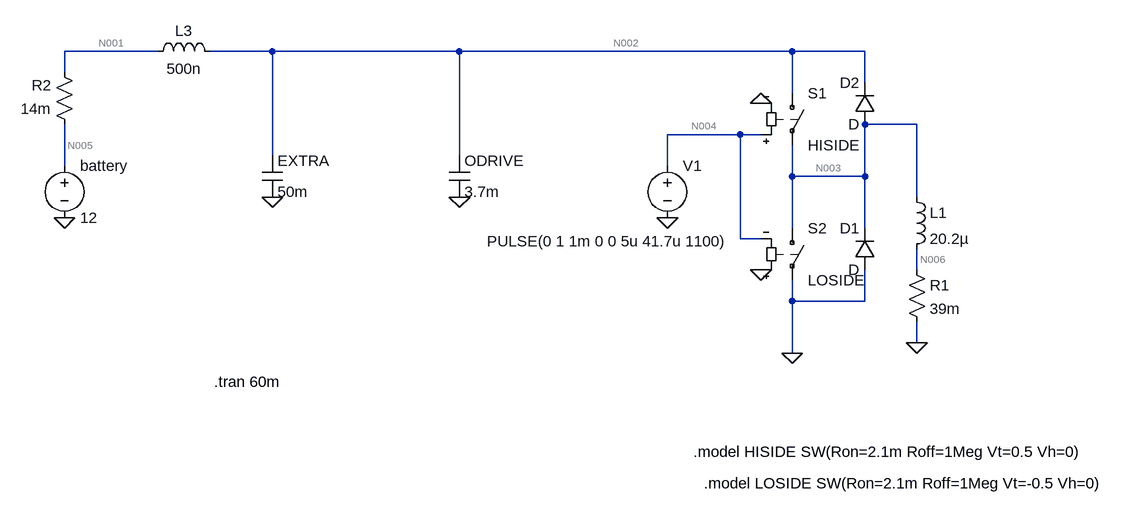
[diagram p0: schematic Single Leg Clutch.asc]
Single Leg Clutch.asc, the LTspice schematic file:
Version 4
SHEET 1 880 756
WIRE -864 -48 -1008 -48
WIRE -688 -48 -784 -48
WIRE -400 -48 -688 -48
WIRE 112 -48 -400 -48
WIRE 224 -48 112 -48
WIRE -1008 -16 -1008 -48
WIRE 224 0 224 -48
WIRE 112 16 112 -48
WIRE 304 64 224 64
WIRE 32 80 -80 80
WIRE 64 80 32 80
WIRE -688 112 -688 -48
WIRE -400 112 -400 -48
WIRE -1008 128 -1008 64
WIRE -80 128 -80 80
WIRE 112 144 112 96
WIRE 224 144 224 64
WIRE 224 144 112 144
WIRE 304 176 304 64
WIRE 112 224 112 144
WIRE 224 224 224 144
WIRE 32 240 32 80
WIRE 64 240 32 240
WIRE 304 288 304 256
WIRE 112 336 112 304
WIRE 224 336 224 288
WIRE 224 336 112 336
WIRE 304 400 304 368
WIRE 112 416 112 336
FLAG 112 416 0
FLAG -688 176 0
FLAG -400 176 0
FLAG -1008 208 0
FLAG 64 32 0
FLAG 64 288 0
FLAG -80 208 0
FLAG 304 400 0
SYMBOL sw 112 0 R0
SYMATTR InstName S1
SYMATTR Value HISIDE
SYMBOL sw 112 208 R0
SYMATTR InstName S2
SYMATTR Value LOSIDE
SYMBOL diode 240 288 R180
WINDOW 0 24 64 Left 2
WINDOW 3 24 0 Left 2
SYMATTR InstName D1
SYMBOL diode 240 64 R180
WINDOW 0 24 64 Left 2
WINDOW 3 24 0 Left 2
SYMATTR InstName D2
SYMBOL cap -416 112 R0
SYMATTR InstName ODRIVE
SYMATTR Value 3.7m
SYMBOL cap -704 112 R0
SYMATTR InstName EXTRA
SYMATTR Value 50m
SYMBOL voltage -1008 112 R0
WINDOW 123 0 0 Left 0
WINDOW 39 0 0 Left 0
SYMATTR InstName battery
SYMATTR Value 12
SYMBOL voltage -80 112 R0
WINDOW 3 -278 132 Left 2
WINDOW 123 0 0 Left 0
WINDOW 39 0 0 Left 0
SYMATTR InstName V1
SYMATTR Value PULSE(0 1 1m 0 0 5u 41.7u 1100)
SYMBOL ind 288 160 R0
SYMATTR InstName L1
SYMATTR Value 20.2µ
SYMBOL res 288 272 R0
SYMATTR InstName R1
SYMATTR Value 39m
SYMBOL res -992 80 R180
WINDOW 0 36 76 Left 2
WINDOW 3 36 40 Left 2
SYMATTR InstName R2
SYMATTR Value 14m
SYMBOL ind -880 -32 R270
WINDOW 0 32 56 VTop 2
WINDOW 3 5 56 VBottom 2
SYMATTR InstName L3
SYMATTR Value 500n
TEXT -778 460 Left 2 !.tran 60m
TEXT -40 568 Left 2 !.model HISIDE SW(Ron=2.1m Roff=1Meg Vt=0.5 Vh=0)
TEXT -24 616 Left 2 !.model LOSIDE SW(Ron=2.1m Roff=1Meg Vt=-0.5 Vh=0)

The netlist it stands for:
* Single Leg Clutch.asc
S1 N002 N003 N004 0 HISIDE
S2 N003 0 0 N004 LOSIDE
D1 0 N003 D
D2 N003 N002 D
C§ODRIVE N002 0 3.7m
C§EXTRA N002 0 50m
V§battery N005 0 12
V1 N004 0 PULSE(0 1 1m 0 0 5u 41.7u 1100)
L1 N003 N006 20.2µ
R1 N006 0 39m
R2 N005 N001 14m
L3 N001 N002 500n
.model D D
.lib standard.dio
.tran 60m
.model HISIDE SW(Ron=2.1m Roff=1Meg Vt=0.5 Vh=0)
.model LOSIDE SW(Ron=2.1m Roff=1Meg Vt=-0.5 Vh=0)
.backanno
.end

* Results of the author's LTspice run, read from the files saved beside the schematic
* Operating Point, zero values left out:
*   V(n002) = 12 V
*   V(n003) = 23.94 nV
*   V(n005) = 12 V
*   V(n006) = 23.34 nV
*   V(n001) = 12 V
*   I(D2) = -12.01 pA
*   I(L3) = 12 µA
*   I(L1) = 598.6 nA
*   I(R2) = 12 µA
*   I(R1) = 598.6 nA
*   I(S2) = -11.4 µA
*   I(S1) = -12 µA
*   I(Battery) = -12 µA
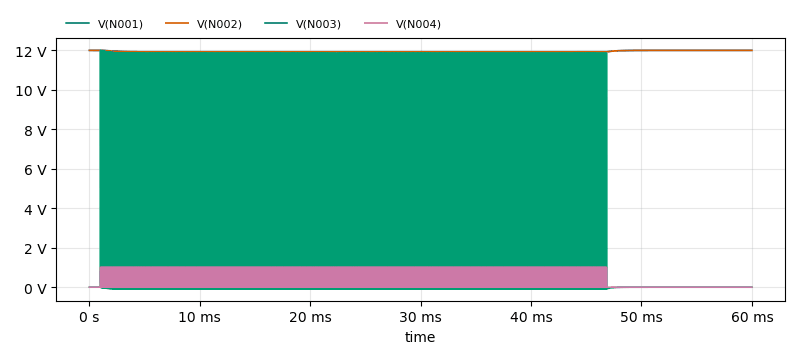
[diagram p1: Transient Analysis of Single Leg Clutch.asc, plotted from the saved traces]
* Transient Analysis, 1 run:
*   V(N001): min 11.93 V, max 12 V, average 11.95 V, rms 11.95 V, last 12 V
*   V(N002): min 11.92 V, max 12 V, average 11.94 V, rms 11.94 V, last 12 V
*   V(N003): min -82.17 mV, max 12 V, average 1.144 V, rms 3.731 V, last 0 V
*   V(N004): min 0 V, max 1 V, average 100.8 mV, rms 313.2 mV, last 0 V